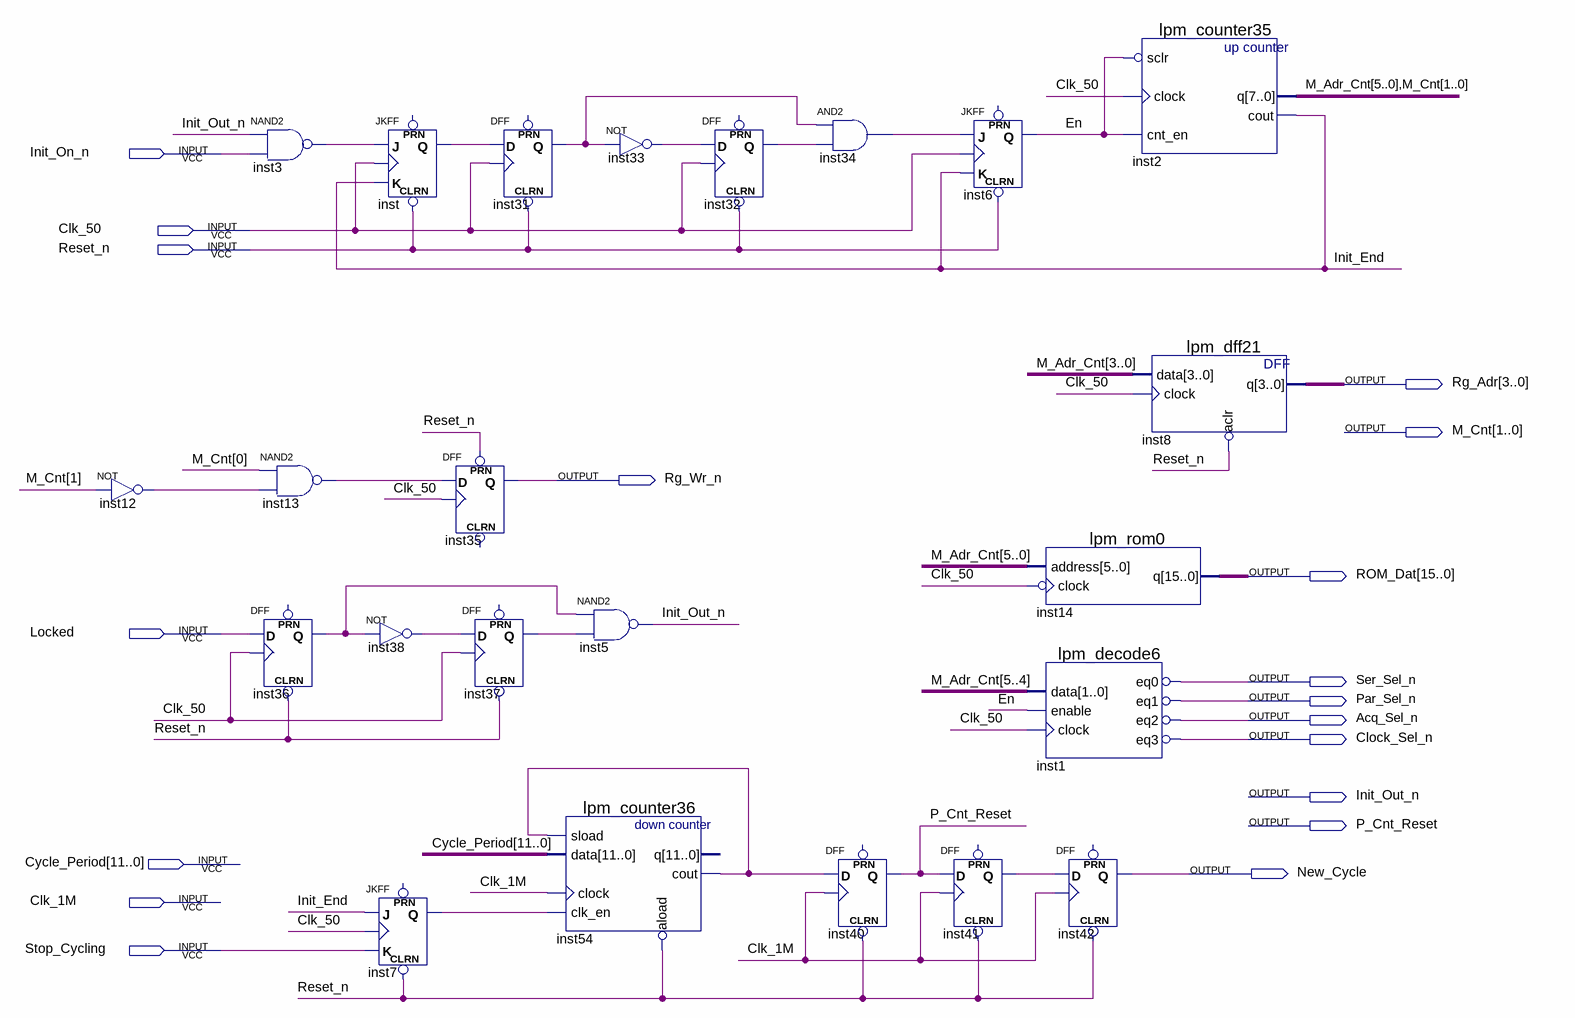
[diagram p0: schematic sheet]
// Quartus schematic Init_Module.bdf as structural Verilog: 23 symbols, 18 pins
module Init_Module (
  input  Init_On_n,
  input  Clk_50,
  input  Reset_n,
  input  Locked,
  input  [11:0] Cycle_Period,
  input  Clk_1M,
  input  Stop_Cycling,
  output [3:0] Rg_Adr,
  output [1:0] M_Cnt,
  output Rg_Wr_n,
  output [15:0] ROM_Dat,
  output Ser_Sel_n,
  output Par_Sel_n,
  output Acq_Sel_n,
  output Clock_Sel_n,
  output Init_Out_n,
  output P_Cnt_Reset,
  output New_Cycle
);

  wire En, Init_End, inst1_eq0, inst1_eq1, inst1_eq2, inst1_eq3, inst3_out, inst7_q, inst12_out, inst13_out,
       inst31_q, inst32_q, inst33_out, inst34_out, inst36_q, inst37_q, inst38_out, inst41_q, inst54_cout,
       inst_q;
  wire [5:0] M_Adr_Cnt;

  not inst12 (inst12_out, M_Cnt[1]);
  nand inst3 (inst3_out, Init_Out_n, Init_On_n);
  nand inst13 (inst13_out, M_Cnt[0], inst12_out);
  DFF inst36 (.CLRN(Reset_n), .CLK(Clk_50), .D(Locked), .Q(inst36_q));  // open: PRN
  JKFF inst (.CLRN(Reset_n), .K(Init_End), .J(inst3_out), .CLK(Clk_50), .Q(inst_q));  // open: PRN
  not inst38 (inst38_out, inst36_q);
  JKFF inst7 (.CLRN(Reset_n), .K(Stop_Cycling), .J(Init_End), .CLK(Clk_50), .Q(inst7_q));  // open: PRN
  DFF inst35 (.CLK(Clk_50), .D(inst13_out), .PRN(Reset_n), .Q(Rg_Wr_n));  // open: CLRN
  DFF inst37 (.CLRN(Reset_n), .CLK(Clk_50), .D(inst38_out), .Q(inst37_q));  // open: PRN
  DFF inst31 (.CLRN(Reset_n), .CLK(Clk_50), .D(inst_q), .Q(inst31_q));  // open: PRN
  not inst33 (inst33_out, inst31_q);
  nand inst5 (Init_Out_n, inst36_q, inst37_q);
  lpm_counter36 inst54 (
    .sload(inst54_cout), .data(Cycle_Period), .clock(Clk_1M), .clk_en(inst7_q), .aload(~Reset_n),
    .cout(inst54_cout));  // open: q
  DFF inst32 (.CLRN(Reset_n), .CLK(Clk_50), .D(inst33_out), .Q(inst32_q));  // open: PRN
  and inst34 (inst34_out, inst31_q, inst32_q);
  DFF inst40 (.CLRN(Reset_n), .CLK(Clk_1M), .D(inst54_cout), .Q(P_Cnt_Reset));  // open: PRN
  JKFF inst6 (.CLRN(Reset_n), .K(Init_End), .J(inst34_out), .CLK(Clk_50), .Q(En));  // open: PRN
  DFF inst41 (.CLRN(Reset_n), .CLK(Clk_1M), .D(P_Cnt_Reset), .Q(inst41_q));  // open: PRN
  lpm_rom0 inst14 (.address(M_Adr_Cnt), .clock(~Clk_50), .q(ROM_Dat));
  lpm_decode6 inst1 (
    .data(M_Adr_Cnt[5:4]), .enable(En), .clock(Clk_50), .eq0(inst1_eq0), .eq1(inst1_eq1), .eq2(inst1_eq2),
    .eq3(inst1_eq3));
  not inst1_eq0_inverted (Ser_Sel_n, inst1_eq0);
  not inst1_eq1_inverted (Par_Sel_n, inst1_eq1);
  not inst1_eq2_inverted (Acq_Sel_n, inst1_eq2);
  not inst1_eq3_inverted (Clock_Sel_n, inst1_eq3);
  DFF inst42 (.CLRN(Reset_n), .CLK(Clk_1M), .D(inst41_q), .Q(New_Cycle));  // open: PRN
  lpm_counter35 inst2 (.sclr(~En), .clock(Clk_50), .cnt_en(En), .q({M_Adr_Cnt, M_Cnt}), .cout(Init_End));
  lpm_dff21 inst8 (.data(M_Adr_Cnt[3:0]), .clock(Clk_50), .aclr(~Reset_n), .q(Rg_Adr));
endmodule
